# Altium schematic sheet MCU_test.SchDoc
size A4; SheetNumber: 5; SheetTotal: 5; SPICEModelCacheIOPLCZQZ: <root> / <DocumentId>IOPLCZQZ</DocumentId> / </root>
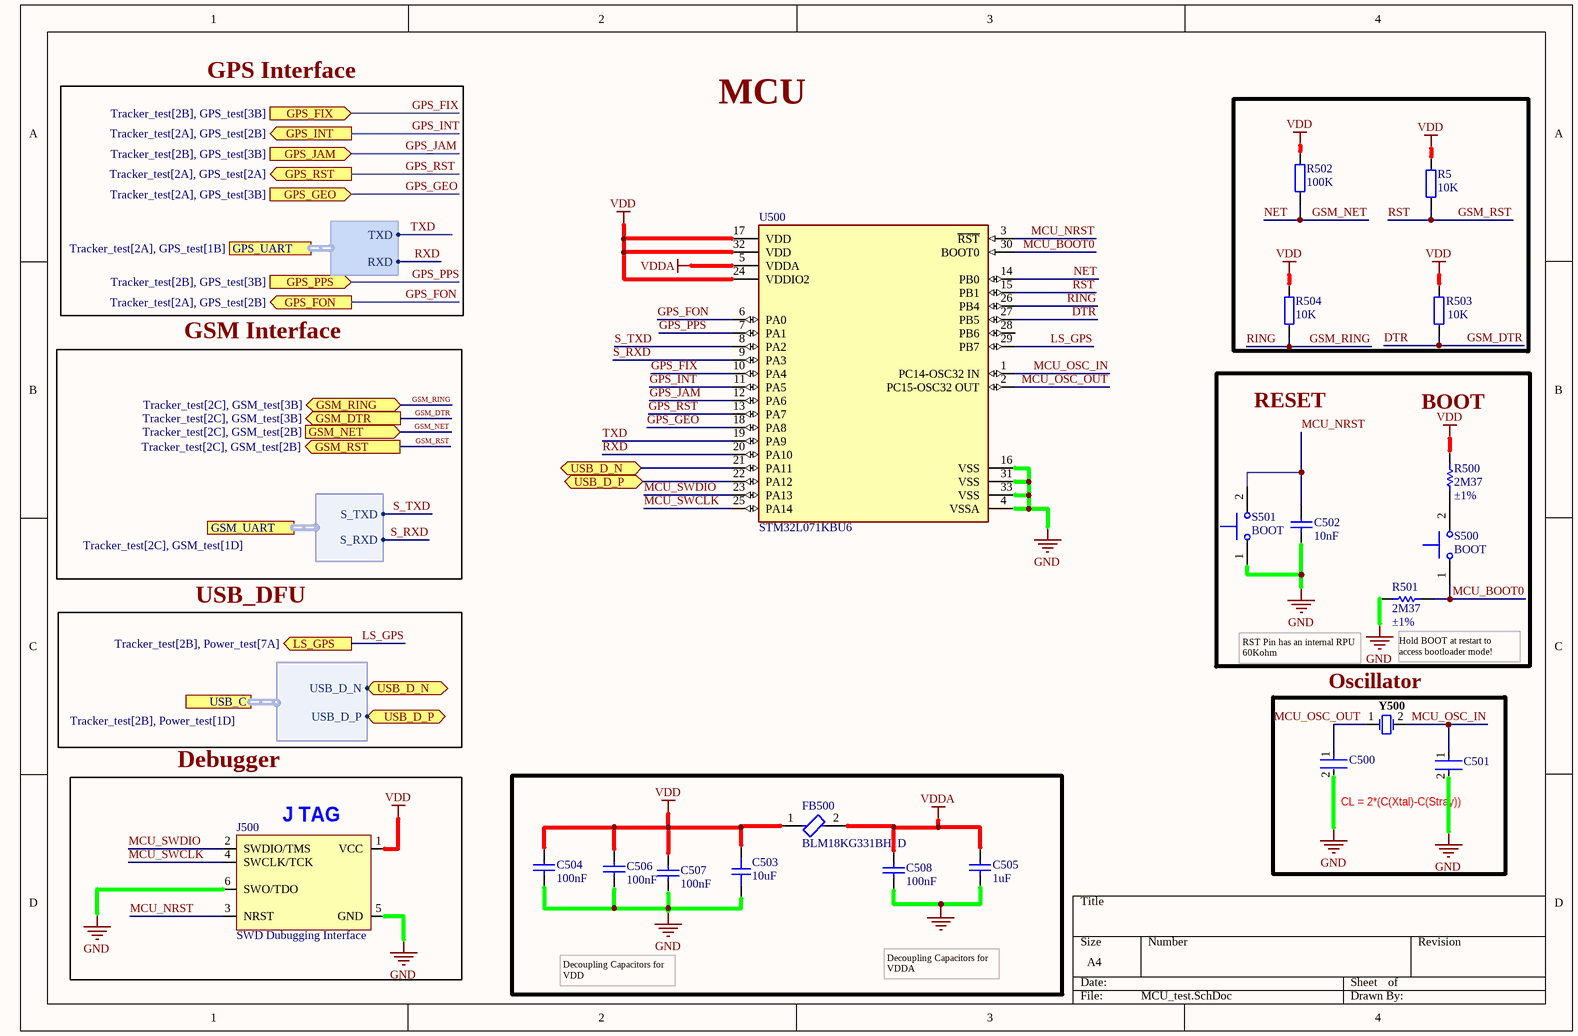
[diagram p0: MCU_test.SchDoc]

## Parts
C500  C0603C220K5RACAUTO  [FP-C0603C-CF-IPC_B]  (value not drawn)
C501  C0603C220K5RACAUTO  [FP-C0603C-CF-IPC_B]  (value not drawn)
C502  value 10nF  [C0402 - duplicate]  (hidden comment: CAP)
C503  10uF  [CAP_0402]
C504  value 100nF  [C0402 - duplicate]  (hidden comment: CAP)
C505  value 1uF  [C0402 - duplicate]  (hidden comment: CAP)
C506  value 100nF  [C0402 - duplicate]  (hidden comment: CAP)
C507  value 100nF  [C0402 - duplicate]  (hidden comment: CAP)
C508  value 100nF  [C0402 - duplicate]  (hidden comment: CAP)
FB500  BLM18KG331BH1D  [FP-BLM18-0_15-t0_8-IPC_A]
J500  SWD Dubugging Interface  [TC2030-NL-FP]  (no BOM)
R5  10K  [RES_0402]
R500  value 2M37  Tolerance: ±1%  [R0402]  (hidden comment: 1K)
R501  value 2M37  Tolerance: ±1%  [R0402]  (hidden comment: 10K)
R502  100K  [RES_0402]
R503  10K  [RES_0402]
R504  10K  [RES_0402]
S500  BOOT  [SW_B3U-1000P]
S501  BOOT  [SW_B3U-1000P]
U500  STM32L071KBU6  [FP-UFQFPN32-A0B8-IPC_B]
Y500  NX3225GD-8MHZ-STD-CRA-3  [NDK-NX3225GD-8MHZ-STD-CRA-3_V]  (value not drawn)

## Blocks framed on the sheet
Debugger: J500

## Ports
GPS_FIX (in, see Tracker_test[2B], GPS_test[3B]), GPS_FON (out, see Tracker_test[2A], GPS_test[2B]), GPS_GEO (in, see Tracker_test[2A], GPS_test[3B]), GPS_INT (out, see Tracker_test[2A], GPS_test[2B]), GPS_JAM (in, see Tracker_test[2B], GPS_test[3B]), GPS_PPS (in, see Tracker_test[2B], GPS_test[3B]), GPS_RST (out, see Tracker_test[2A], GPS_test[2A]), GPS_UART (harness GPS_UART, see Tracker_test[2A], GPS_test[1B]), GSM_DTR (out, see Tracker_test[2C], GSM_test[3B]), GSM_NET (in, see Tracker_test[2C], GSM_test[2B]), GSM_RING (bidir, see Tracker_test[2C], GSM_test[3B]), GSM_RST (out, see Tracker_test[2C], GSM_test[2B]), GSM_UART (harness GSM_UART, see Tracker_test[2C], GSM_test[1D]), LS_GPS (out, see Tracker_test[2B], Power_test[7A]), USB_C (harness USB_C, see Tracker_test[2B], Power_test[1D]), USB_D_N (bidir), USB_D_P (bidir)

## Harnesses
GPS_UART: TXD, RXD
GSM_UART: S_TXD, S_RXD
USB_C: USB_D_N, USB_D_P

## Nets
GND: C500.2 C501.2 C502.2 C503.1 C504.2 C505.2 C506.2 C507.2 C508.2 J500.5(GND) J500.6(SWO/TDO) R501.1 S501.1 U500.4(VSSA) U500.16(VSS) U500.31(VSS) U500.33(VSS)
VDD: C503.2 C504.1 C506.1 C507.1 FB500.1 J500.1(VCC) R5.1 R500.1 R502.1 R503.2 R504.1 U500.17(VDD) U500.24(VDDIO2) U500.32(VDD)
VDDA: C505.1 C508.1 FB500.2 U500.5(VDDA)
DTR: R503.1 U500.27(PB5) ; port GSM_DTR  [also labelled GSM_DTR]
GPS_FIX: U500.10(PA4) ; port GPS_FIX
GPS_FON: U500.6(PA0) ; port GPS_FON
GPS_GEO: U500.18(PA8) ; port GPS_GEO
GPS_INT: U500.11(PA5) ; port GPS_INT
GPS_JAM: U500.12(PA6) ; port GPS_JAM
GPS_PPS: U500.7(PA1) ; port GPS_PPS
GPS_RST: U500.13(PA7) ; port GPS_RST
GSM_NET: R502.2 U500.14(PB0) ; port GSM_NET  [also labelled NET]
GSM_RING: R504.2 U500.26(PB4) ; port GSM_RING  [also labelled RING]
GSM_RST: R5.2 U500.15(PB1) ; port GSM_RST  [also labelled RST]
LS_GPS: U500.29(PB7) ; port LS_GPS
MCU_BOOT0: R501.2 S500.1 U500.30(BOOT0)
MCU_NRST: C502.1 J500.3(NRST) S501.2 U500.3(~{RST})
MCU_OSC_IN: C501.1 U500.1(PC14-OSC32_IN) Y500.2
MCU_OSC_OUT: C500.1 U500.2(PC15-OSC32_OUT) Y500.1
MCU_SWCLK: J500.4(SWCLK/TCK) U500.25(PA14)
MCU_SWDIO: J500.2(SWDIO/TMS) U500.23(PA13)
RXD: U500.20(PA10) ; port GPS_UART.RXD
S_RXD: U500.9(PA3) ; port GSM_UART.S_RXD
S_TXD: U500.8(PA2) ; port GSM_UART.S_TXD
TXD: U500.19(PA9) ; port GPS_UART.TXD
USB_D_N: U500.21(PA11) ; port USB_D_N, port USB_C.USB_D_N
USB_D_P: U500.22(PA12) ; port USB_D_P, port USB_C.USB_D_P
NetR500_2: R500.2 S500.2

Not connected (* = marked no-connect by the designer): U500 28(PB6)

## Notes on the sheet
- GPS Interface
- MCU
- GSM Interface
- RESET
- BOOT
- USB_DFU
- RST Pin has an internal RPU 60Kohm
- (near R501) Hold BOOT at restart to
  access bootloader mode!
- (near Y500) Oscillator
- (near J500) J TAG
- CL = 2*(C(Xtal)-C(Stray))
- Decoupling Capacitors for VDD
- Decoupling Capacitors for VDDA

## Library data of the parts
C500 C501 = CMP-03020-018041-1: Cap Ceramic 22pF 50V X7R 10% SMD 0603 125°C Punched Paper T/R; Manufacturer: KEMET; Tolerance: 0.1; Temperature Coefficient: 30ppm/°C; Automotive Grade: Grade 1; Capacitance: 22 pF; Temperature Range High: +125°C; Height: 0.87mm; Automotive: Yes; Temperature Range Low: -55°C; Category: Cap; Digikey Description: Cap Ceramic 22pF 50V X7R 10% SMD 0603 125°C Punched Paper T/R; Temperature Characteristic: X7R; Device Class L3: Ceramic Capacitors; ComponentLink2URL: https://api.kemet.com/component-edge/download/datasheet/C0603C100J5GACAUTO.pdf; Manufacturer Part Number: C0603C220K5RACAUTO; Value: 22 pF; Device Class L1: Passive Components; Package: C0603C-CF; Material: Ceramic; RoHS: TRUE; Lead Free: Yes; ComponentLink2Description: Datasheet; Device Class L2: Capacitors; Mouser Description: Cap Ceramic 22pF 50V X7R 10% SMD 0603 125°C Punched Paper T/R; Temperature: -55°C to +125°C; Octopart: https://octopart.com/c0603c220k5racauto-kemet-70963357; Voltage Rating: 50 V
C502 C504-C508 = CAP: CAP CER 0.1UF 10V X7R 0603; Part Number: C00062; Manufacturer: KEMET - Electronic Component; Manufacturer Part Number: C0603C104K8RACTU; Tolerance: ±10%; Supplier 1: Digi-Key; Supplier Part Number 1: 399-1095-2-ND; HelpURL: http://www.kemet.com/Lists/ProductCatalog/Attachments/53/KEM_C1002_X7R_SMD.pdf; Operating Temperature: -55°C ~ 125°C; Type: CER; Temperature Coefficient: X7R; Voltage: 10V
C503 = CAP_0402: Capacitor SMD 0402; Manufacturer: *; Manufacturer Part Number: *; Distributor Link: *; LCSC: *; Rating: *; Dielectric: *
FB500 = CMP-06046-002312-1: Chip Ferrite Bead, 0603, 330Ω @ 100MHz, 0.08Ω, 25%, 1.2A; DC Resistance (DCR): 80mR; Number of Lines: 1; Case/Package: 0603; Max Operating Temperature: 150°C; Max Current Rating: 1.2A; Case Code (Metric): 1608; Case Code (Imperial): 0603; RoHS Compliant: Yes; Ratings: AEC-Q200; Min Operating Temperature: -55°C
J500 = TC2030-NL: Tag-Connect No-Solder SWD Debug Connector (No Legs) DO NOT PLACE; Manufacturer: Tag-Connect; Manufacturer Part Number: TC2030-NL-FP
R5 R502-R504 = RES_0402: Resistor SMD 0402; Manufacturer: *; Manufacturer Part Number: *; Distributor Link: *; LCSC: *
R500 R501 = RES: RES SMD 15 OHM 1% 1/10W 0603; Part Number: R00007; Manufacturer: Yageo; Manufacturer Part Number: RC0603FR-0715RL; Temperature Coefficient: ±100ppm/°C; Supplier 1: Digi-Key; Supplier Part Number 1: 311-15.0HRCT-ND; HelpURL: http://www.yageo.com/NewPortal/yageodocoutput?fileName=/pdf/R-Chip/PYu-RC_Group_51_RoHS_L_3.pdf; Power: 1/10W; Operating Temperature: -55°C ~ 155°C
S500 S501 = B3U-1000P: SWITCH TACTILE SPST-NO 0.05A 12V; Manufacturer: Omron Electronic Components; SymbolCreator: a0412235; VDC_V: 12; SwitchFunction: Off-Mom; PositionCount: 1; CurrentRating_mA: 50; SymbolVersion: 2012-10-29; PartNumber: B3U-1000P; MountType: SMT; ComponentLink1Description: Datasheet URL; ComponentLink1URL: http://www.components.omron.com/components/web/PDFLIB.nsf/0/2DD3893C7DD33E9E862572900079E9D6/$file/B3U_1110.pdf; RoHS: Y; Circuit: SPST-NO; Orientation: Top Actuated; CompType: Switch; PackageReference: 3x1.6x2.5mm; Publisher: Texas Instruments; LatestRevisionDate: 2015-03-16; Supplier 1: Digi-Key; Supplier Part Number 1: SW1020CT-ND; Supplier 2: Mouser; Supplier Part Number 2: 653-B3U-1000P; Supplier 3: Farnell; Supplier Part Number 3: 1333652
U500 = CMP-12105-000059-1: IC MCU 32BIT 128KB FLASH 32QFPN; Manufacturer: STMicroelectronics; Number Of Uart Channels: 4; Number Of Adc Channels: 10; Max Junction Temp: +105°C; Number Of Cores: 1; Min Supply Voltage: 1.8V; Interface: I2C,SPI,UART,USART,LIN,IrDA,SMBus,Other; Frequency: 32MHz; Data Bus Width: 32bits; Number Of Timers/Counters: 9; Core Architecture: Arm Cortex-M0+; Number Of I2C Channels: 2; Memory Size: 128KBytes; Ram Size: 20KBytes; Number Of I/Os: 23; Max Supply Voltage: 3.6V; Device Class L3: Microcontrollers; Lead Free: Yes; Memory Type: FLASH; Ambient Temperature Range High: +85°C; RoHS: TRUE; ComponentLink2Description: Datasheet; Device Class L1: Integrated Circuits (ICs); Automotive: No; Temperature Range Low: -40°C; Octopart: https://octopart.com/stm32l071kbu6-stmicroelectronics-67270308; Ipc Land Pattern Name: QFN50P500X500X55-32; Number Of A/D Converters: 1; Height: 0.6mm; Manufacturer Part Number: STM32L071KBU6; Temperature Range High: +85°C; Digikey Description: IC MCU 32BIT 128KB FLASH 32QFPN; Mouser Description: ARM Microcontrollers - MCU; Category: IC; Number Of Spi Channels: 4; ComponentLink2URL: https://www.st.com/resource/en/datasheet/stm32l071cb.pdf; Ambient Temperature Range Low: -40°C; Package: UFQFPN32-A0B8; Device Class L2: Embedded Processors and Controllers; Temperature: -40°C to +85°C
Y500 = CMP-2000-07595-1: Crystal Unit, 8 MHz, 8 pF, -40 to 150 degC, 2-Pin SMD, RoHS, Tape and Reel; Manufacturer: NDK; Load Capacitance: 8pF; ESR (Equivalent Series Resistance): 500Ohm; Frequency Tolerance: 50ppm; Frequency Stability: 150ppm; Frequency: 8MHz; Case/Package: SMD/SMT; Datasheet Version: 11/2016; Min Operating Temperature: -40degC; Packaging: TapeandReel; Width: 0.098inch; Package Quantity: 3000; Number of Pins: 2; Package Description: 2-Pin Surface Mount Device, Body 3.2 x 2.5 mm; RoHSCompliant: True; Package Reference: NX3225GD-8MHZ-STD-CRA-3; Datasheet URL: http://www.ndk.com/images/products/catalog/c_NX3225GD-STD-CRA-3_e.pdf; Mounting Technology: SurfaceMount; Length: 0.126inch; Mount: SurfaceMount; Manufacturer URL: http://www.ndk.com/en/; Max Operating Temperature: 150degC; Height: 0.039inch